# Altium schematic sheet 03_DETECTOR_COMPARATOR.SchDoc
size A; SheetNumber: 3; SheetTotal: 3
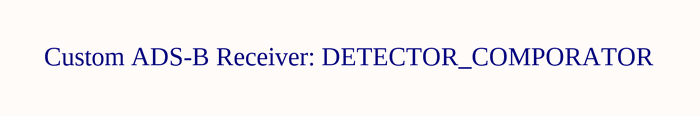
[diagram p0: 03_DETECTOR_COMPARATOR.SchDoc]

## Notes on the sheet
- Custom ADS-B Receiver: DETECTOR_COMPORATOR